# EAGLE schematic PlacaComNode (EAGLE 9.1.1)
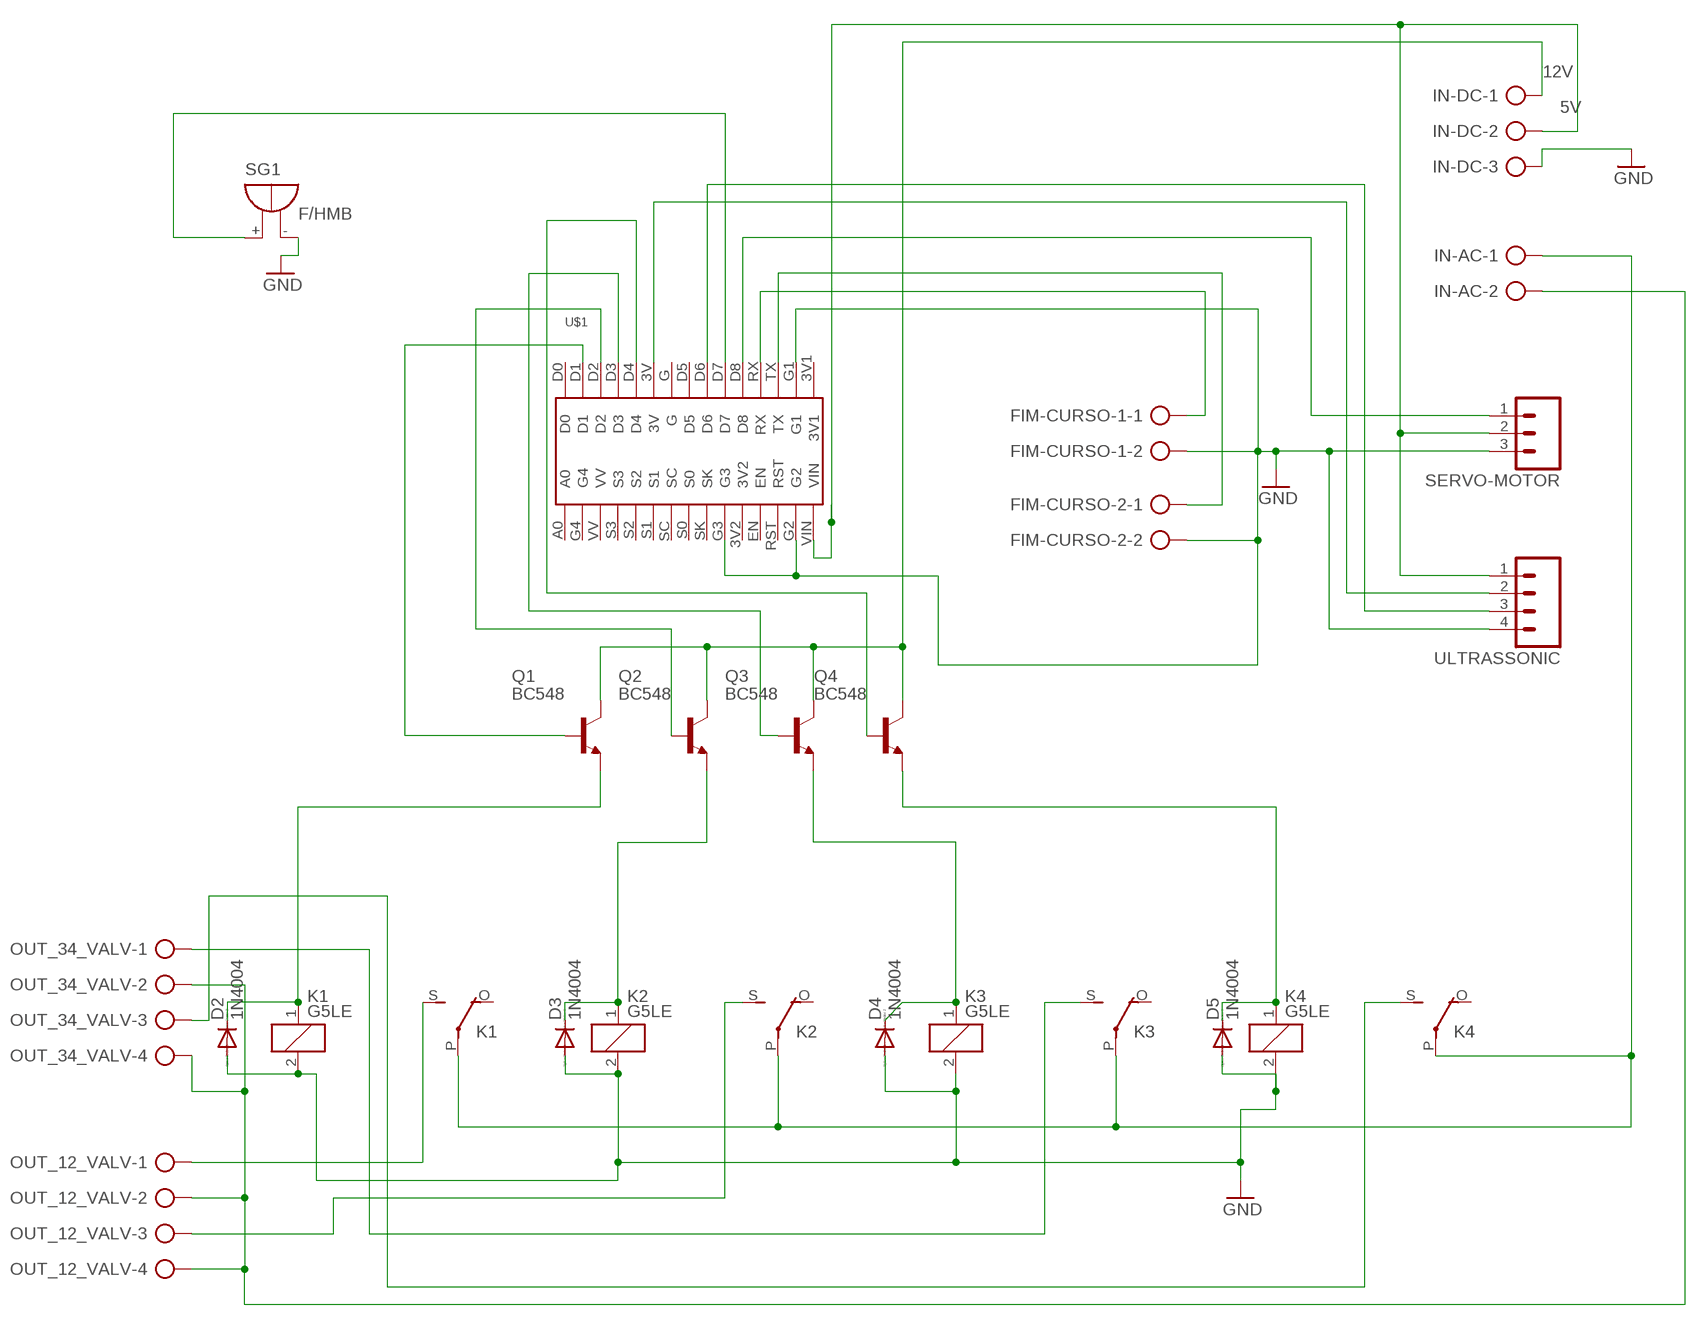
[diagram p0: schematic, sheet 1]

## Parts
D2  1N4004  [DO41-10]
D3  1N4004  [DO41-10]
D4  1N4004  [DO41-10]
D5  1N4004  [DO41-10]
FIM-CURSO-1  AK500/2-H  [AK500/2-H]
FIM-CURSO-2  AK500/2-H  [AK500/2-H]
IN-AC  AK500/2-H  [AK500/2-H]
IN-DC  AK500/3-H  [AK500/3-H]
K1  G5LE  [G5LE]
K2  G5LE  [G5LE]
K3  G5LE  [G5LE]
K4  G5LE  [G5LE]
OUT_12_VALV  AK500/4-H  [AK500/4-H]
OUT_34_VALV  AK500/4-H  [AK500/4-H]
Q1  BC548  [TO92-EBC]
Q2  BC548  [TO92-EBC]
Q3  BC548  [TO92-EBC]
Q4  BC548  [TO92-EBC]
SERVO-MOTOR  M03  [03P]
SG1  F/HMB  [F/HMB]
U$1  LOLIN  [LOLIN]
ULTRASSONIC  M04  [04P]

## Nets
5V: IN-DC.2 SERVO-MOTOR.2 U$1.VIN ULTRASSONIC.1
12V: IN-DC.1 Q1.C Q2.C Q3.C Q4.C
GND: D2.A D3.A D4.A D5.A FIM-CURSO-1.2 FIM-CURSO-2.2 IN-DC.3 K1.2 K2.2 K3.2 K4.2 SERVO-MOTOR.3 SG1.- U$1.G1 U$1.G2 U$1.G3 ULTRASSONIC.4
N$1: D5.C K4.1 Q4.E
N$3: D3.C K2.1 Q2.E
N$7: D2.C K1.1 Q1.E
N$8: Q1.B U$1.D1
N$9: D4.C K3.1 Q3.E
N$10: Q2.B U$1.D2
N$11: Q3.B U$1.D3
N$12: Q4.B U$1.D4
N$14: K1.S(2:S) OUT_12_VALV.1
N$15: K2.S(2:S) OUT_12_VALV.3
N$16: K3.S(2:S) OUT_34_VALV.1
N$17: K4.S(2:S) OUT_34_VALV.3
N$18: IN-AC.1 K1.P(2:P) K2.P(2:P) K3.P(2:P) K4.P(2:P)
N$19: SERVO-MOTOR.1 U$1.D8
N$20: FIM-CURSO-1.1 U$1.RX
N$21: FIM-CURSO-2.1 U$1.TX
N$23: U$1.3V ULTRASSONIC.2
N$24: SG1.+ U$1.D7
N$25: U$1.D6 ULTRASSONIC.3
N$27: IN-AC.2 OUT_12_VALV.2 OUT_12_VALV.4 OUT_34_VALV.2 OUT_34_VALV.4
Unconnected: K1.O(2:O) K2.O(2:O) K3.O(2:O) K4.O(2:O) U$1.3V1 U$1.3V2 U$1.A0 U$1.D0 U$1.D5 U$1.EN U$1.G U$1.G4 U$1.RST U$1.S0 U$1.S1 U$1.S2 U$1.S3 U$1.SC U$1.SK U$1.VV

## Library data of the parts
D2-D5 = diode:1N4004: DIODE general purpose rectifier, 1 A
FIM-CURSO-1 FIM-CURSO-2 IN-AC = con-ptr500:AK500/2-H: CONNECTOR Aug. 2004 / PTR Meßtechnik: Die Bezeichnung der Serie AK505 wurde geändert. Es handelt sich hierbei um AK500 in horizontaler Ausführung.; OC_FARNELL: unknown; OC_NEWARK: unknown
IN-DC = con-ptr500:AK500/3-H: CONNECTOR Aug. 2004 / PTR Meßtechnik: Die Bezeichnung der Serie AK505 wurde geändert. Es handelt sich hierbei um AK500 in horizontaler Ausführung.; OC_FARNELL: unknown; OC_NEWARK: unknown
K1-K4 = relay:G5LE: RELAY 1 x switch, 10 A/120 V AC, 8 A/30 V DC, Omron; OC_FARNELL: unknown; OC_NEWARK: unknown
OUT_12_VALV OUT_34_VALV = con-ptr500:AK500/4-H: CONNECTOR Aug. 2004 / PTR Meßtechnik: Die Bezeichnung der Serie AK505 wurde geändert. Es handelt sich hierbei um AK500 in horizontaler Ausführung.; OC_FARNELL: unknown; OC_NEWARK: unknown
Q1-Q4 = transistor-npn:BC548*: NPN Transistor
SERVO-MOTOR = con-amp-quick:M03: AMP QUICK CONNECTOR; OC_FARNELL: unknown; OC_NEWARK: unknown
SG1 = buzzer:F/HMB: BUZZER Source: Buerklin; OC_FARNELL: unknown; OC_NEWARK: unknown
U$1 = Lolin:LOLIN
ULTRASSONIC = con-amp-quick:M04: AMP QUICK CONNECTOR; OC_FARNELL: unknown; OC_NEWARK: unknown